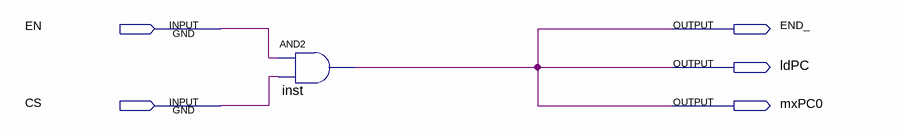
[diagram p0: schematic sheet]
// Quartus schematic JMP.bdf as structural Verilog: 1 symbols, 5 pins
module JMP (
  input  EN,
  input  CS,
  output END_,
  output ldPC,
  output mxPC0
);

  and inst (END_, EN, CS);

  assign ldPC = END_;
  assign mxPC0 = END_;
endmodule
